# EAGLE design M111C (EAGLE 6.6.0)
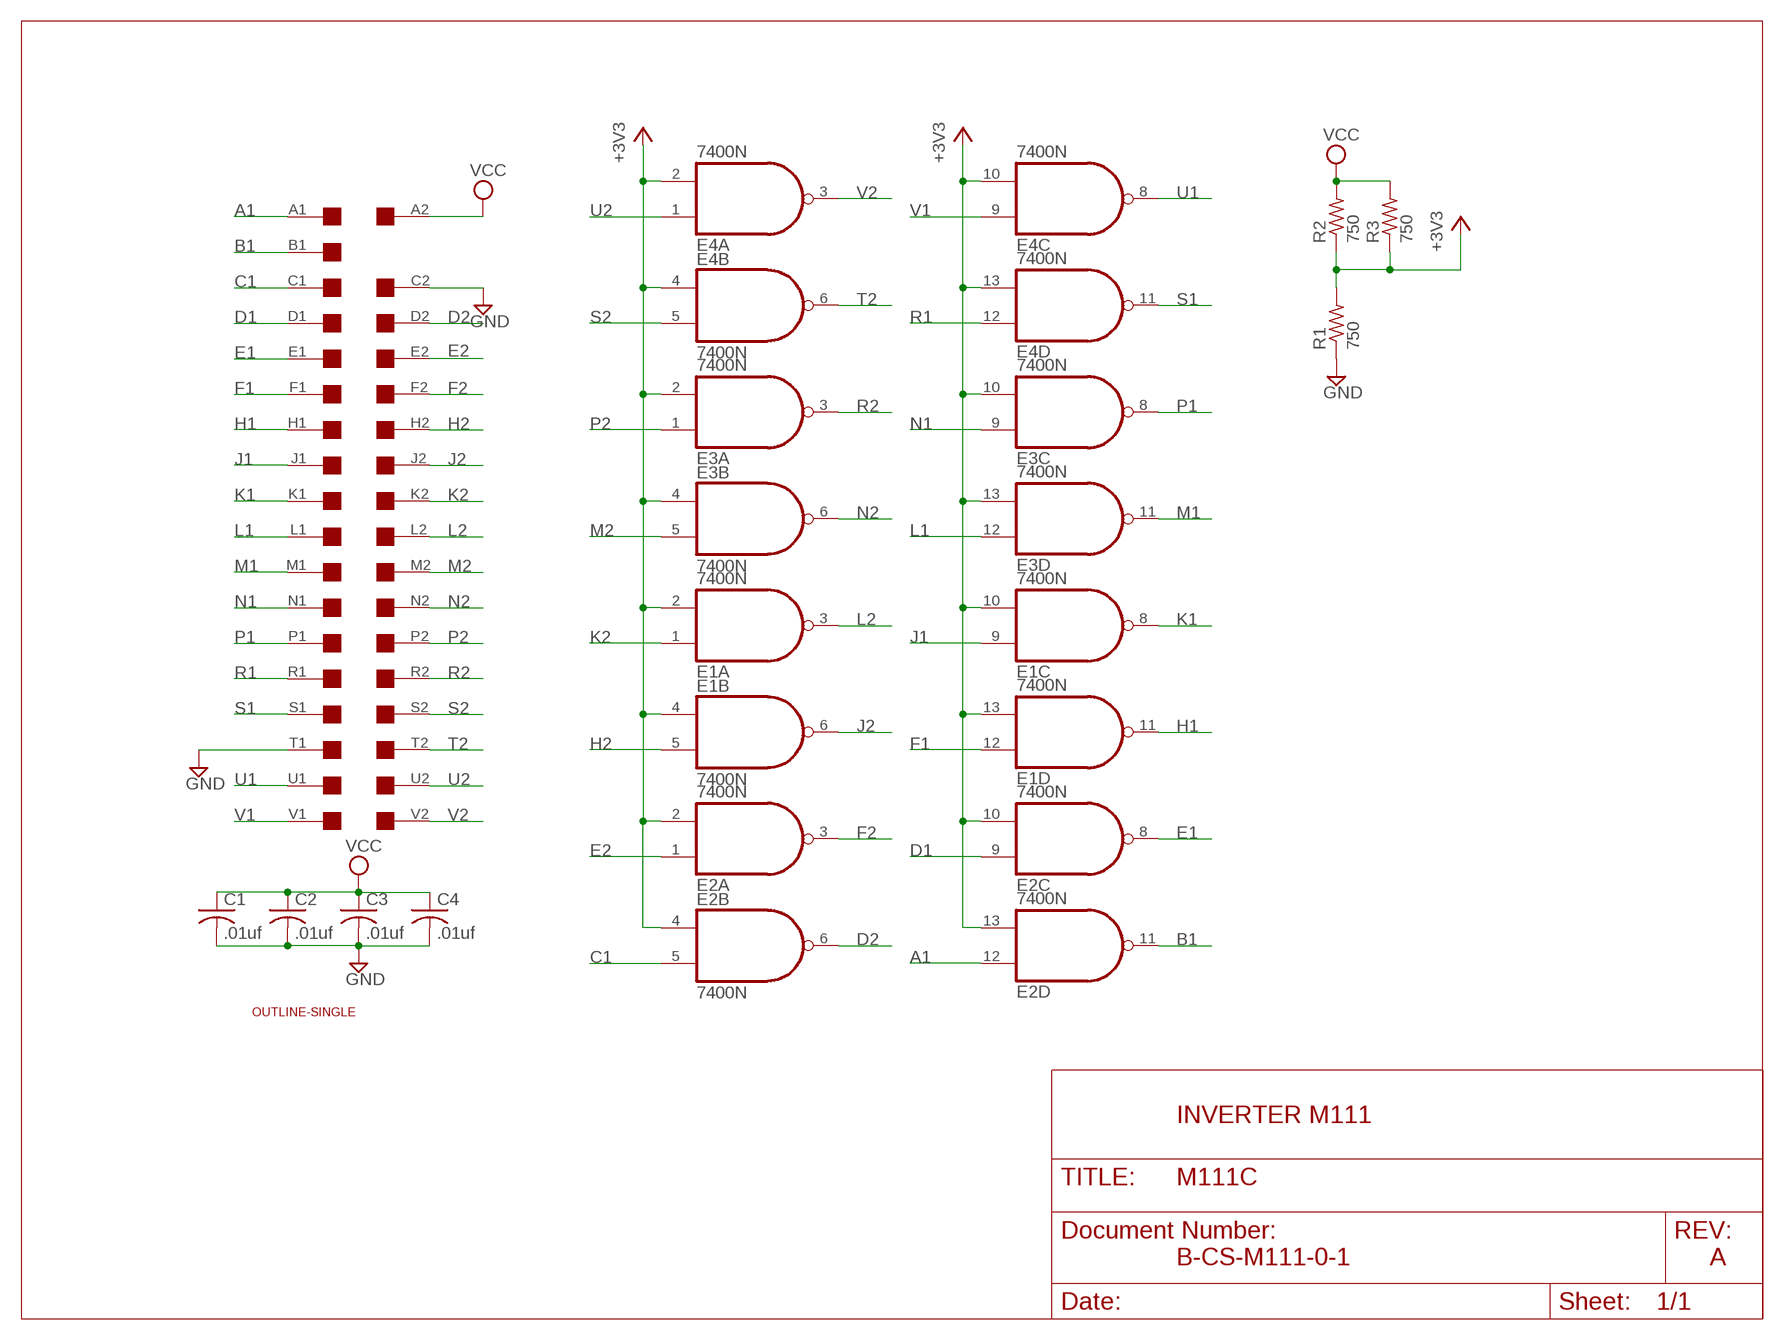
[diagram p0: schematic, sheet 1]

## Parts
A  EDGE-2CONNECTOR  [EDGE-CON2]
C1  .01uf  C-US050-025X075  [C050-025X075]
C2  .01uf  C-US050-025X075  [C050-025X075]
C3  .01uf  C-US050-025X075  [C050-025X075]
C4  .01uf  C-US050-025X075  [C050-025X075]
E1  7400N  [DIL14]
E2  7400N  [DIL14]
E3  7400N  [DIL14]
E4  7400N  [DIL14]
R1  750  R-US_0207/10  [0207/10]
R2  750  R-US_0207/10  [0207/10]
R3  750  R-US_0207/10  [0207/10]
U$1  OUTLINE-SINGLE  [SINGLE]

## Nets
+3V3: E1.2(A:I1) E1.4(B:I0) E1.10(C:I1) E1.13(D:I1) E2.2(A:I1) E2.4(B:I0) E2.10(C:I1) E2.13(D:I1) E3.2(A:I1) E3.4(B:I0) E3.10(C:I1) E3.13(D:I1) E4.2(A:I1) E4.4(B:I0) E4.10(C:I1) E4.13(D:I1) R1.2 R2.1 R3.1
A1: A.A1 E2.12(D:I0)
B1: A.B1 E2.11(D:O)
C1: A.C1 E2.5(B:I1)
D1: A.D1 E2.9(C:I0)
D2: A.D2 E2.6(B:O)
E1: A.E1 E2.8(C:O)
E2: A.E2 E2.1(A:I0)
F1: A.F1 E1.12(D:I0)
F2: A.F2 E2.3(A:O)
GND [Supply]: A.C2 A.T1 C1.2 C2.2 C3.2 C4.2 R1.1
H1: A.H1 E1.11(D:O)
H2: A.H2 E1.5(B:I1)
J1: A.J1 E1.9(C:I0)
J2: A.J2 E1.6(B:O)
K1: A.K1 E1.8(C:O)
K2: A.K2 E1.1(A:I0)
L1: A.L1 E3.12(D:I0)
L2: A.L2 E1.3(A:O)
M1: A.M1 E3.11(D:O)
M2: A.M2 E3.5(B:I1)
N1: A.N1 E3.9(C:I0)
N2: A.N2 E3.6(B:O)
P1: A.P1 E3.8(C:O)
P2: A.P2 E3.1(A:I0)
R1: A.R1 E4.12(D:I0)
R2: A.R2 E3.3(A:O)
S1: A.S1 E4.11(D:O)
S2: A.S2 E4.5(B:I1)
T2: A.T2 E4.6(B:O)
U1: A.U1 E4.8(C:O)
U2: A.U2 E4.1(A:I0)
V1: A.V1 E4.9(C:I0)
V2: A.V2 E4.3(A:O)
VCC [Supply]: A.A2 C1.1 C2.1 C3.1 C4.1 R2.2 R3.2
Unconnected: A.B2

## Notes on the sheet
- INVERTER M111
- B-CS-M111-0-1 | A

## Power pins joined to a net without a drawn wire
GND: E1.7(P:GND) E2.7(P:GND) E3.7(P:GND) E4.7(P:GND)
VCC: E1.14(P:VCC) E2.14(P:VCC) E3.14(P:VCC) E4.14(P:VCC)

## Library data of the parts
A = dec-con:EDGE-2: Double-Sided DEC edge connector.
C1-C4 = rcl:C-US: CAPACITOR, American symbol
E1-E4 = 74xx-us:74*00: Quad 2-input NAND gate
R1-R3 = rcl:R-US_: RESISTOR, American symbol
U$1 = dec-con:OUTLINE-*: Board outlines for DEC boards.

## Net classes
1 Supply: width 0.813 mm

## Board
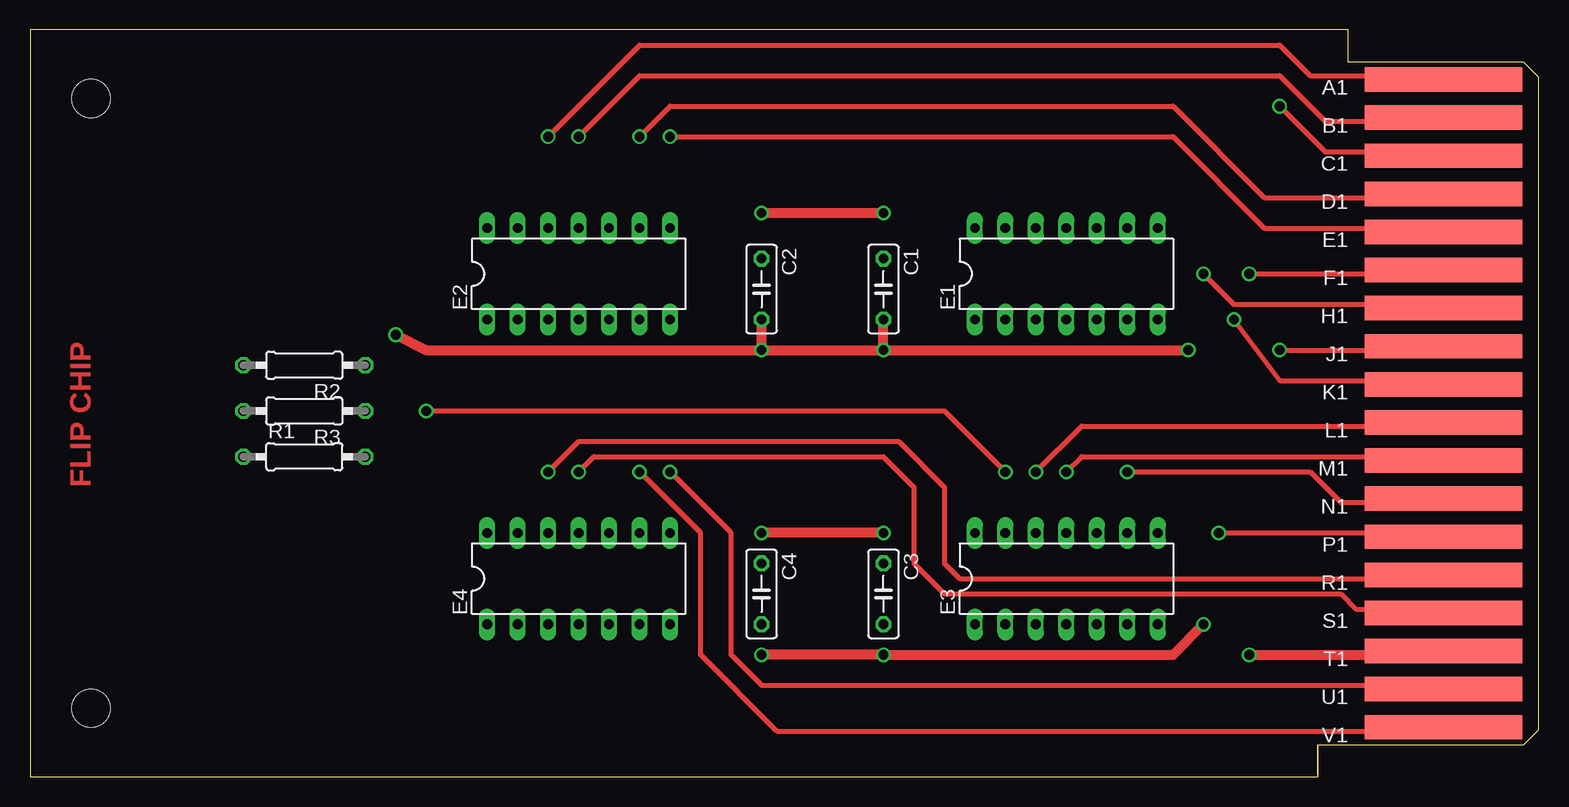
[diagram p1: board, top side]
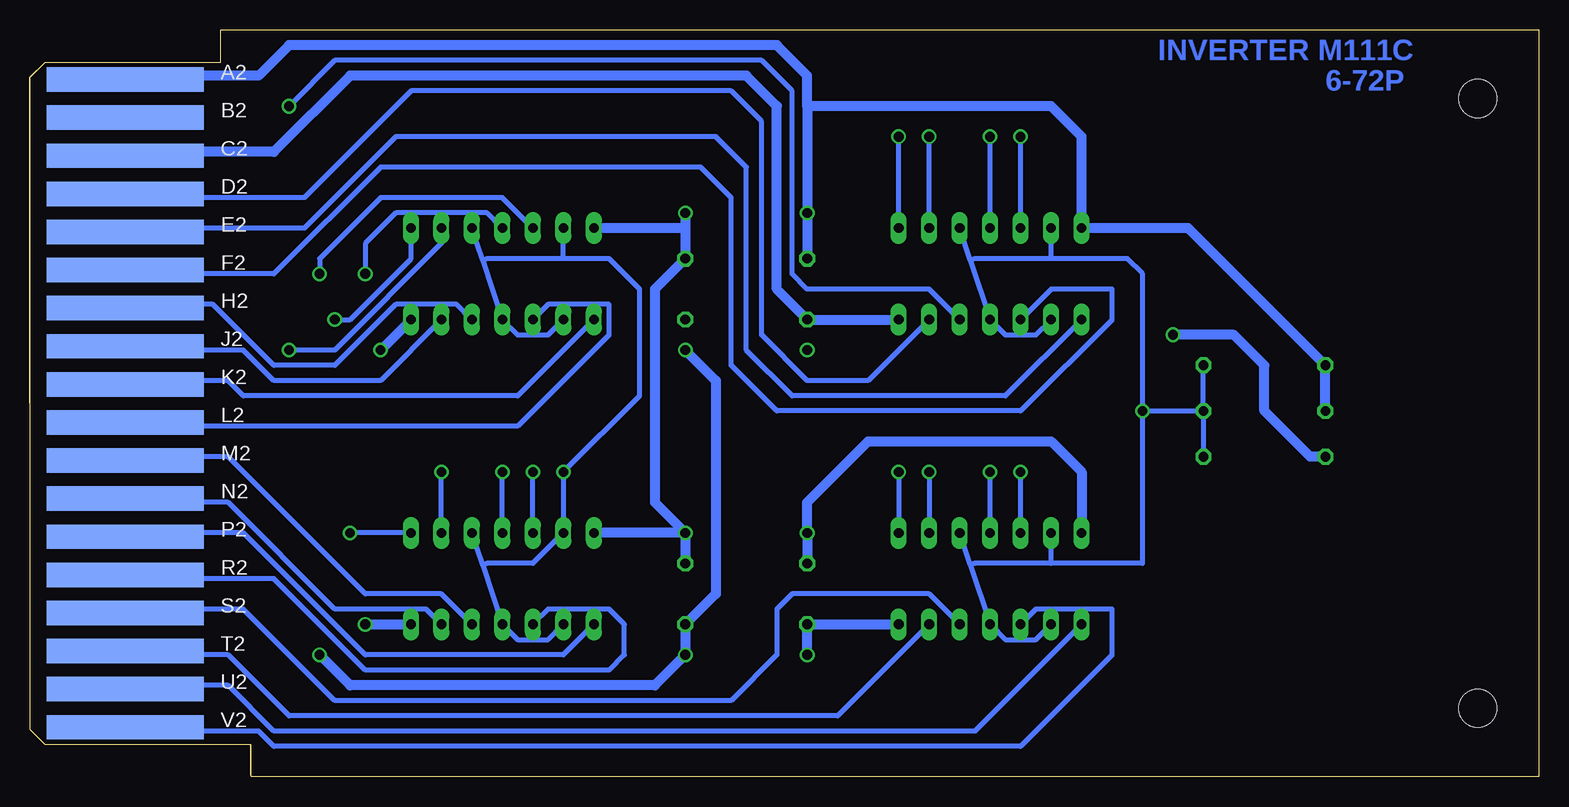
[diagram p2: board, bottom side, seen from below]

Size 125.73 x 62.23 mm. Coordinates in mm from the lower left corner, seen from the top.
Copper layers (1+16): Top 0.035mm / dielectric 1.5mm / Bottom 0.035mm
Design rules "16mils": minimum track width 16mil, minimum drill 32mil, track to track 15mil, track to pad 10mil, pad to pad 10mil, via to via 10mil, smd to smd 10mil, copper to edge 13mil, drill to drill 10mil, minimum pad ring 10mil, minimum via ring 8mil, stop-mask expansion 0mil, vias tented up to drill 0mil, thermal gap 10mil

### Footprints (pad centres in the part's own frame; a part is rotated, then mirrored left to right if it is on the bottom)
EDGE-CON2 = smd 13.106 x 2.032: A1 7.938,4.128; B1 7.938,7.303; C1 7.938,10.477; D1 7.938,13.652; E1 7.938,16.828; F1 7.938,20.003; H1 7.938,23.177; J1 7.938,26.352; K1 7.938,29.527; L1 7.938,32.703; M1 7.938,35.877; N1 7.938,39.053; P1 7.938,42.227; R1 7.938,45.403; S1 7.938,48.578; T1 7.938,51.752; U1 7.938,54.928; V1 7.938,58.102 | smd 13.106 x 2.032 bottom: A2 7.938,4.128; B2 7.938,7.303; C2 7.938,10.477; D2 7.938,13.652; E2 7.938,16.828; F2 7.938,20.003; H2 7.938,23.177; J2 7.938,26.352; K2 7.938,29.527; L2 7.938,32.703; M2 7.938,35.877; N2 7.938,39.053; P2 7.938,42.227; R2 7.938,45.403; S2 7.938,48.578; T2 7.938,51.752; U2 7.938,54.928; V2 7.938,58.102
C050-025X075 = drill 0.813 octagon: 1 -2.54,0; 2 2.54,0
DIL14 = drill 0.813 long: 1 -7.62,-3.81; 2 -5.08,-3.81; 3 -2.54,-3.81; 4 0,-3.81; 5 2.54,-3.81; 6 5.08,-3.81; 7 7.62,-3.81; 8 7.62,3.81; 9 5.08,3.81; 10 2.54,3.81; 11 0,3.81; 12 -2.54,3.81; 13 -5.08,3.81; 14 -7.62,3.81
0207/10 = drill 0.813 octagon: 1 -5.08,0; 2 5.08,0
SINGLE = hole 3.175: 120.65,56.515; 120.65,5.715

### Placement (x,y rotation side)
A  125.73,62.23 180 top
C1  71.12,40.64 270 top
C2  60.96,40.64 270 top
C3  71.12,15.24 270 top
C4  60.96,15.24 270 top
E1  86.36,41.91 0 top
E2  45.72,41.91 0 top
E3  86.36,16.51 0 top
E4  45.72,16.51 0 top
R1  22.86,26.67 0 top
R2  22.86,34.29 180 top
R3  22.86,30.48 180 top
U$1  125.73,62.23 180 top

### Tracks (layer width: path | path; a pad name or v marks a point on that pad's centre or on a via)
+3V3  (via drill 0.81)
  Top 0.406: v33.02,30.48 76.2,30.48 v81.28,25.4
  Bottom 0.406: R3.1 R2.1 | R3.1 R1.2 | E2.2 41.91,36.83 44.45,36.83 E2.4 47.37,43.05 | 40.64,43.18 E2.13 | 47.37,43.05 E2.10 | v33.02,30.48 33.02,41.91 34.29,43.18 40.64,43.18 | v33.02,30.48 R3.1 | E4.2 41.91,11.43 44.45,11.43 E4.4 47.37,17.65 | 47.37,17.65 E4.10 | 40.64,17.78 E4.13 | 40.64,17.78 33.02,17.78 v33.02,30.48 | 47.37,17.65 46.99,17.78 40.64,17.78 | 47.37,43.05 46.99,43.18 40.64,43.18 | E3.2 82.55,11.43 85.09,11.43 E3.4 88.01,17.65 | 88.01,17.65 E3.10 | 88.01,17.65 87.63,17.78 83.82,17.78 E3.13 v81.28,25.4 74.93,31.75 74.93,40.64 77.47,43.18 81.28,43.18 | E1.2 82.55,36.83 85.09,36.83 E1.4 88.01,43.05 | 88.01,43.05 E1.10 | 81.28,43.18 E1.13 | 88.01,43.05 87.63,43.18 81.28,43.18
A1  (via drill 0.81)
  Top 0.406: A.A1 112.16,58.02 111.76,58.42 | 111.76,58.42 111.76,58.02 | 111.76,58.42 106.68,58.42 104.14,60.96 50.8,60.96 v43.18,53.34
  Bottom 0.406: E2.12 v43.18,53.34
B1  (via drill 0.81)
  Top 0.406: A.B1 112.05,54.9 111.76,54.61 107.95,54.61 104.14,58.42 50.8,58.42 v45.72,53.34
  Bottom 0.406: E2.11 v45.72,53.34
C1  (via drill 0.81)
  Top 0.406: A.C1 112.09,51.74 111.76,52.07 107.95,52.07 v104.14,55.88
  Bottom 0.406: v104.14,55.88 100.33,59.69 64.77,59.69 62.23,57.15 62.23,41.91 60.96,40.64 50.8,40.64 E2.5
D1  (via drill 0.81)
  Top 0.406: A.D1 112.06,48.56 111.76,48.26 102.87,48.26 95.25,55.88 53.34,55.88 v50.8,53.34
  Bottom 0.406: E2.9 v50.8,53.34
D2
  Bottom 0.406: A.D2 112.06,48.56 111.76,48.26 102.87,48.26 93.98,57.15 67.31,57.15 64.77,54.61 64.77,36.83 60.96,33.02 55.88,33.02 E2.6
E1  (via drill 0.81)
  Top 0.406: A.E1 112.09,45.39 111.76,45.72 102.87,45.72 95.25,53.34 v53.34,53.34
  Bottom 0.406: E2.8 v53.34,53.34
E2
  Bottom 0.406: A.E2 112.09,45.39 111.76,45.72 102.87,45.72 95.25,53.34 68.58,53.34 66.04,50.8 66.04,35.56 62.23,31.75 44.45,31.75 E2.1
F1  (via drill 0.81)
  Top 0.406: A.F1 112.04,42.19 111.76,41.91 v101.6,41.91
  Bottom 0.406: E1.12 86.36,48.26 96.52,48.26 101.6,43.18 v101.6,41.91
F2
  Bottom 0.406: A.F2 112.04,42.19 111.76,41.91 105.41,41.91 96.52,50.8 69.85,50.8 67.31,48.26 67.31,34.29 63.5,30.48 43.18,30.48 35.56,38.1 35.56,40.64 40.64,40.64 E2.3
GND  (via drill 0.81)
  Top 0.813: v30.48,36.83 33.02,35.56 v60.96,35.56 | v60.96,35.56 C2.2 | v60.96,35.56 v71.12,35.56 | v71.12,35.56 C1.2 | v71.12,35.56 v96.52,35.56 | v60.96,10.16 v71.12,10.16 95.25,10.16 v97.79,12.7 | A.T1 112.09,10.49 111.76,10.16 v101.6,10.16
  Bottom 0.813: R1.1 19.05,26.67 22.86,30.48 22.86,34.29 25.4,36.83 v30.48,36.83 | E2.7 C2.2 63.5,40.64 63.5,55.88 66.04,58.42 99.06,58.42 105.41,52.07 111.76,52.07 112.09,51.74 A.C2 | v96.52,35.56 E1.7 | v60.96,10.16 C4.2 E4.7 | v97.79,12.7 E3.7 | v71.12,35.56 68.58,33.02 68.58,15.24 C3.2 v71.12,10.16 73.66,7.62 99.06,7.62 v101.6,10.16
H1  (via drill 0.81)
  Top 0.406: A.H1 112.09,39.04 111.76,39.37 100.33,39.37 v97.79,41.91
  Bottom 0.406: v97.79,41.91 97.79,44.45 95.25,46.99 87.63,46.99 E1.11
H2
  Bottom 0.406: A.H2 112.09,39.04 111.76,39.37 110.49,39.37 105.41,34.29 100.33,34.29 95.25,39.37 90.17,39.37 E1.5
J1  (via drill 0.81)
  Top 0.406: A.J1 112.09,35.89 111.76,35.56 v104.14,35.56
  Bottom 0.406: v104.14,35.56 100.33,35.56 91.44,44.45 E1.9
J2
  Bottom 0.406: A.J2 112.09,35.89 111.76,35.56 107.95,35.56 105.41,33.02 96.52,33.02 E1.6
K1  (via drill 0.81)
  Top 0.406: A.K1 112.06,32.72 111.76,33.02 104.14,33.02 v100.33,38.1
  Bottom 0.406: v100.33,38.1 99.06,38.1 93.98,43.18 E1.8
K2
  Bottom 0.406: A.K2 112.06,32.72 111.76,33.02 109.22,33.02 107.95,31.75 85.09,31.75 E1.1
L1  (via drill 0.81)
  Top 0.406: A.L1 112.09,29.54 111.76,29.21 87.63,29.21 v83.82,25.4
  Bottom 0.406: E3.12 v83.82,25.4
L2
  Bottom 0.406: A.L2 113.97,29.54 113.03,29.21 85.09,29.21 77.47,36.83 77.47,39.37 82.55,39.37 E1.3
M1  (via drill 0.81)
  Top 0.406: A.M1 112.09,26.34 111.76,26.67 87.63,26.67 v86.36,25.4
  Bottom 0.406: E3.11 v86.36,25.4
M2
  Bottom 0.406: E3.5 91.44,15.24 97.79,15.24 109.22,26.67 113.03,26.67 113.36,26.34 A.M2
N1  (via drill 0.81)
  Top 0.406: A.N1 112.09,23.19 111.76,22.86 109.22,22.86 106.68,25.4 v91.44,25.4
  Bottom 0.406: E3.9 v91.44,25.4
N2
  Bottom 0.406: E3.6 92.71,13.97 100.33,13.97 109.22,22.86 115.57,22.86 115.9,23.19 A.N2
P1  (via drill 0.81)
  Top 0.406: A.P1 112.09,19.99 111.76,20.32 v99.06,20.32
  Bottom 0.406: E3.8 v99.06,20.32
P2
  Bottom 0.406: E3.1 81.28,10.16 97.79,10.16 107.95,20.32 111.76,20.32 112.09,19.99 A.P2
R1  (via drill 0.81)
  Top 0.406: A.R1 112.09,16.84 111.76,16.51 77.47,16.51 76.2,17.78 76.2,24.13 72.39,27.94 45.72,27.94 v43.18,25.4
  Bottom 0.406: E4.12 v43.18,25.4
R2
  Bottom 0.406: E3.3 82.55,13.97 77.47,13.97 76.2,12.7 76.2,10.16 77.47,8.89 97.79,8.89 105.41,16.51 111.76,16.51 112.09,16.84 A.R2
S1  (via drill 0.81)
  Top 0.406: A.S1 112.06,13.66 111.76,13.97 110.49,13.97 109.22,15.24 76.2,15.24 73.66,17.78 73.66,24.13 71.12,26.67 46.99,26.67 v45.72,25.4
  Bottom 0.406: E4.11 v45.72,25.4
S2
  Bottom 0.406: E4.5 50.8,15.24 62.23,15.24 63.5,13.97 63.5,10.16 67.31,6.35 100.33,6.35 107.95,13.97 113.03,13.97 114,13.66 A.S2
T2
  Bottom 0.406: A.T2 112.09,10.49 111.76,10.16 109.22,10.16 104.14,5.08 58.42,5.08 E4.6
U1  (via drill 0.81)
  Top 0.406: A.U1 112.12,7.26 111.76,7.62 60.96,7.62 58.42,10.16 58.42,20.32 v53.34,25.4
  Bottom 0.406: v53.34,25.4 E4.8
U2
  Bottom 0.406: A.U2 112.12,7.26 111.76,7.62 109.22,7.62 105.41,3.81 46.99,3.81 E4.1
V1  (via drill 0.81)
  Top 0.406: A.V1 111.76,3.81 62.23,3.81 55.88,10.16 55.88,20.32 v50.8,25.4
  Bottom 0.406: v50.8,25.4 E4.9
V2
  Bottom 0.406: A.V2 112.15,4.2 111.76,3.81 106.68,3.81 105.41,2.54 43.18,2.54 35.56,10.16 35.56,13.97 41.91,13.97 E4.3
VCC  (via drill 0.81)
  Top 0.813: v60.96,46.99 v71.12,46.99 | v71.12,20.32 v60.96,20.32
  Bottom 0.813: R3.2 R2.2 29.21,45.72 E2.14 38.1,53.34 40.64,55.88 60.96,55.88 | A.A2 112.16,58.02 111.76,58.42 106.68,58.42 104.14,60.96 63.5,60.96 60.96,58.42 60.96,55.88 | C2.1 v60.96,46.99 60.96,55.88 | v71.12,46.99 71.12,45.72 | 71.12,45.72 C1.1 73.66,40.64 73.66,22.86 v71.12,20.32 | 71.12,45.72 E1.14 | v71.12,20.32 C3.1 | C4.1 v60.96,20.32 60.96,22.86 55.88,27.94 40.64,27.94 38.1,25.4 E4.14 | v71.12,20.32 E3.14

### Text on the board
Top: FLIP CHIP
Bottom: INVERTER M111C | 6-72P